# EAGLE design Dawson_Dolansky_sch (EAGLE 9.6.2)
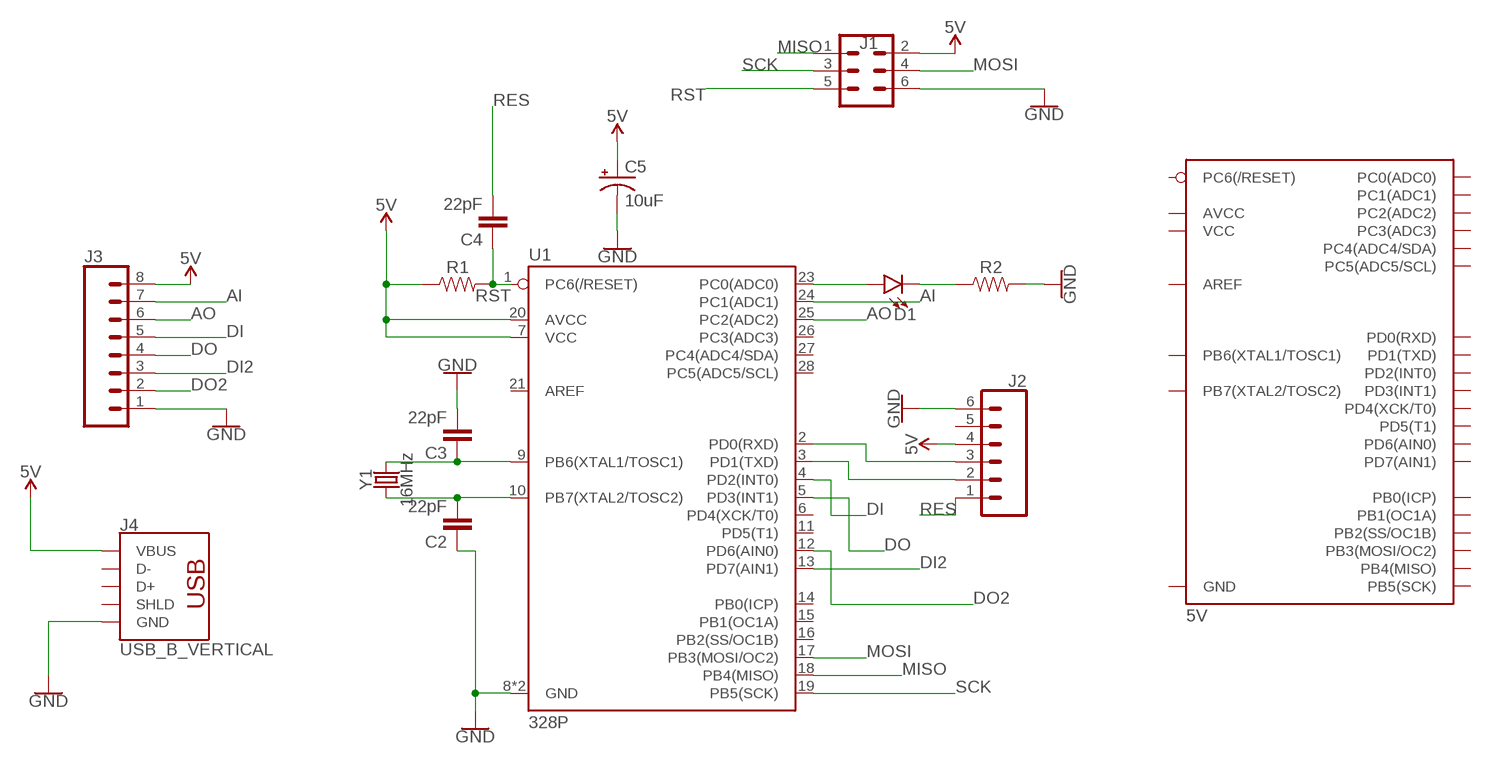
[diagram p0: schematic, sheet 1]

## Parts
C2  22pF  22PF-PTH-2.54MM-200V-5%  [CAP-PTH-2.54]
C3  22pF  22PF-PTH-2.54MM-200V-5%  [CAP-PTH-2.54]
C4  22pF  22PF-PTH-2.54MM-200V-5%  [CAP-PTH-2.54]
C5  10uF  10UF-POLAR-RADIAL-2.5MM-25V-20%  [CPOL-RADIAL-2.5MM-5MM]
D1  LED5MM  [LED_5MM]
J1  CONN_03X22X3_SILK_MALE_PTH  [2X3]
J2  CONN_06SILK_FEMALE_PTH  [1X06]
J3  CONN_08"  [1X08]
J4  USB_B_VERTICAL  [USB_B_VERTICAL_PTH]
R1  RESISTORAXIAL-0.3  [AXIAL-0.3]
R2  RESISTORAXIAL-0.3  [AXIAL-0.3]
U1  328P  ATMEGA328P_PDIP  [DIP28]
Y1  16MHz  CRYSTAL-16MHZPTH-HC49US  [HC49US]

## Nets
5V: C5.1(+) J1.2 J2.4 J3.8 J4.1(VBUS) R1.P$1 U1.7(VCC) U1.20(AVCC)
AI: J3.7 U1.24(PC1(ADC1))
AO: J3.6 U1.25(PC2(ADC2))
DI: J3.5 U1.4(PD2(INT0))
DI2: J3.3 U1.13(PD7(AIN1))
DO: J3.4 U1.5(PD3(INT1))
DO2: J3.2 U1.12(PD6(AIN0))
GND: C2.1 C3.2 C5.2(-) J1.6 J2.6 J3.1 J4.4(GND) R2.P$2 U1.8(GND) U1.22(GND)
MISO: J1.1 U1.18(PB4(MISO))
MOSI: J1.4 U1.17(PB3(MOSI/OC2))
N$2: C2.2 U1.10(PB7(XTAL2/TOSC2)) Y1.1
N$3: C3.1 U1.9(PB6(XTAL1/TOSC1)) Y1.2
N$4: J2.2 U1.3(PD1(TXD))
N$5: J2.3 U1.2(PD0(RXD))
N$13: D1.A U1.23(PC0(ADC0))
N$21: D1.K(C) R2.P$1
RES: C4.2 J2.1
RST: C4.1 J1.5 R1.P$2 U1.1(PC6(/RESET))
SCK: J1.3 U1.19(PB5(SCK))
Unconnected: J2.5 J4.2(D-) J4.3(D+) J4.5(SHLD) J4.6(SHLD) U1.6(PD4(XCK/T0)) U1.11(PD5(T1)) U1.14(PB0(ICP)) U1.15(PB1(OC1A)) U1.16(PB2(SS/OC1B)) U1.21(AREF) U1.26(PC3(ADC3)) U1.27(PC4(ADC4/SDA)) U1.28(PC5(ADC5/SCL))

## Library data of the parts
C2-C4 = JMU_intro:22PF: 22pF ceramic capacitors A capacitor is a passive two-terminal electrical component used to store electrical energy temporarily in an electric field.; PROD_ID: CAP-09128
C5 = JMU_intro:10UF-POLAR: 10.0µF polarized capacitors A capacitor is a passive two-terminal electrical component used to store electrical energy temporarily in an electric field.; PROD_ID: CAP-08440
D1 = JMU_intro:LED: LED (Generic) Standard schematic elements and footprints for 5mm, 3mm, 1206, and 0603 sized LEDs. Generic LEDs with no color specified.
J1 = JMU_intro:CONN_03X2: Multi connection point. Often used as Generic Header-pin footprint for 0.1 inch spaced/style header connections You can populate with any combo of single row headers, but if you'd like an exact match, check these: Header - 2x3 (Male, 0.1") <https://www.sparkfun.com/products/12807> (PRT-12807) Header - 2x3 (Female, 0.1") <https://www.sparkfun.com/products/13010> (PRT-13010) 2x3 Pin Shrouded Header <https://www.sparkfun.com/products/10877> (PRT-10877) On any of the 0.1 inch spaced packages, you can populate with these: Break Away Headers - Straight <https://www.sparkfun.com/products/116> (PRT-00116) Break Away Male Headers - Right Angle <https://www.sparkfun.com/products/553> (PRT-00553) Female Headers <https://www.sparkfun.com/products/115> (PRT-00115) Break Away Headers - Machine Pin <https://www.sparkfun.com/products/117> (PRT-00117) Break Away Female Headers - Swiss Machine Pin <https://www.sparkfun.com/products/743> (PRT-00743) Special note: the shrouded connector mates well with our 3x2 ribbon cables: Ribbon Crimp Connector - 6-pin (2x3, Female) <https://www.sparkfun.com/products/10651> (PRT-10651) Ribbon Cable - 6 wire (15ft) <https://www.sparkfun.com/products/10646> (PRT-10646); PROD_ID: CONN-09701
J2 = JMU_intro:CONN_06: Multi connection point. Often used as Generic Header-pin footprint for 0.1 inch spaced/style header connections On any of the 0.1 inch spaced packages, you can populate with these: Break Away Headers - Straight <https://www.sparkfun.com/products/116> (PRT-00116) Break Away Male Headers - Right Angle <https://www.sparkfun.com/products/553> (PRT-00553) Female Headers <https://www.sparkfun.com/products/115> (PRT-00115) Break Away Headers - Machine Pin <https://www.sparkfun.com/products/117> (PRT-00117) Break Away Female Headers - Swiss Machine Pin <https://www.sparkfun.com/products/743> (PRT-00743) Arduino Stackable Header - 6 Pin <https://www.sparkfun.com/products/9280> (PRT-09280) For SCREWTERMINALS and SPRING TERMINALS visit here: Screw Terimnals on SparkFun.com <https://www.sparkfun.com/search/results?term=Screw+Terminals> (5mm/3.5mm/2.54mm spacing) This device is also useful as a general connection point to wire up your design to another part of your project. Our various solder wires solder well into these plated through hole pads. Hook-Up Wire - Assortment (Stranded, 22 AWG) <https://www.sparkfun.com/products/11375> (PRT-11375) Hook-Up Wire - Assortment (Solid Core, 22 AWG) <https://www.sparkfun.com/products/11367> (PRT-11367) View the entire wire category on our website here <https://www.sparkfun.com/categories/141>; PROD_ID: CONN-08437
J3 = JMU_intro:CONN_08: Multi connection point. Often used as Generic Header-pin footprint for 0.1 inch spaced/style header connections On any of the 0.1 inch spaced packages, you can populate with these: Break Away Headers - Straight <https://www.sparkfun.com/products/116> (PRT-00116) Break Away Male Headers - Right Angle <https://www.sparkfun.com/products/553> (PRT-00553) Female Headers <https://www.sparkfun.com/products/115> (PRT-00115) Break Away Headers - Machine Pin <https://www.sparkfun.com/products/117> (PRT-00117) Break Away Female Headers - Swiss Machine Pin <https://www.sparkfun.com/products/743> (PRT-00743) Arduino Stackable Header - 8 Pin <https://www.sparkfun.com/products/9279> (PRT-09279) For SCREWTERMINALS and SPRING TERMINALS visit here: Screw Terimnals on SparkFun.com <https://www.sparkfun.com/search/results?term=Screw+Terminals> (5mm/3.5mm/2.54mm spacing) This device is also useful as a general connection point to wire up your design to another part of your project. Our various solder wires solder well into these plated through hole pads. Hook-Up Wire - Assortment (Stranded, 22 AWG) <https://www.sparkfun.com/products/11375> (PRT-11375) Hook-Up Wire - Assortment (Solid Core, 22 AWG) <https://www.sparkfun.com/products/11367> (PRT-11367) View the entire wire category on our website here <https://www.sparkfun.com/categories/141> Special notes: Molex polarized connector foot print use with SKU : PRT-08231 with associated crimp pins and housings. 1MM SMD Version SKU: PRT-10208 NOTES ON THE VARIANTS LOCK and LOCK_LONGPADS... This footprint was designed to help hold the alignment of a through-hole component (i.e. 6-pin header) while soldering it into place. You may notice that each hole has been shifted either up or down by 0.005 of an inch from it's more standard position (which is a perfectly straight line). This slight alteration caused the pins (the squares in the middle) to touch the edges of the holes. Because they are alternating, it causes a "brace" to hold the component in place. 0.005 has proven to be the perfect amount of "off-center" position when using our standard breakaway headers. Although looks a little odd when you look at the bare footprint, once you have a header in there, the alteration is very hard to notice. Also,if you push a header all the way into place, it is covered up entirely on the bottom side.; PROD_ID: CONN-08438
J4 = JMU_intro:USB_B: USB Type B Connector SparkFun Products: SparkFun Stepoko <https://www.sparkfun.com/products/13899> PTH
R1 R2 = JMU_intro:RESISTOR: Generic Resistor Package
U1 = JMU_intro:ATMEGA328P_PDIP: Atmel 328P Through hole ATMEGA328P uC used in the Arduino 32kb flash, 1k EEPROM, 2k SRAM Datasheet <http://www.sparkfun.com/datasheets/Components/SMD/ATMega328.pdf> SparkFun Products Storefront component: AVR 28 Pin 20MHz 32K 6A/D - ATMega328P <https://www.sparkfun.com/products/9061> (COM-09061) SparkFun Simon Says - Through-Hole Soldering Kit <https://www.sparkfun.com/products/10547> (KIT-10547) SparkFun Learn to Solder - Simon Says <https://www.sparkfun.com/products/13708> (KIT-13708) SparkFun BigTime Watch Kit <https://www.sparkfun.com/products/11734> (KIT-11734) SparkFun ClockIt <https://www.sparkfun.com/products/10930> (KIT-10930) SparkFun Serial Enabled LCD Kit <https://www.sparkfun.com/products/10097> (LCD-10097) SparkFun Simon Tilts - Through Hole Soldering Kit <https://www.sparkfun.com/products/12634> (KIT-12634) SparkFun Frequency Counter Kit <https://www.sparkfun.com/products/10140> (KIT-10140) FabFM Radio Kit <https://www.sparkfun.com/products/11043> (KIT-11043) SparkFun Binary Blaster Kit <https://www.sparkfun.com/products/12037> (KIT-12037) SparkFun Metro-Gnome <https://www.sparkfun.com/products/9236> (KIT-09236) ATmega328 with Arduino Optiboot (Uno) <https://www.sparkfun.com/products/10524> (DEV-10524); PROD_ID: IC-09136
Y1 = JMU_intro:CRYSTAL-16MHZ: 16MHz Crystal Digikey Example <http://www.digikey.com/product-search/en?keywords=535-9122-1-ND> Frequency: 16MHz Frequency Stability: ±50ppm Frequency Tolerance: ±20ppm Load Capacitance: 18pF SparkFun Products: Pro Micro -5V/16MHz <https://www.sparkfun.com/products/12640> SparkFun Serial Enabled LCD Kit <https://www.sparkfun.com/products/10097>; PROD_ID: XTAL-08181; SF_ID: COM-00536

## Board
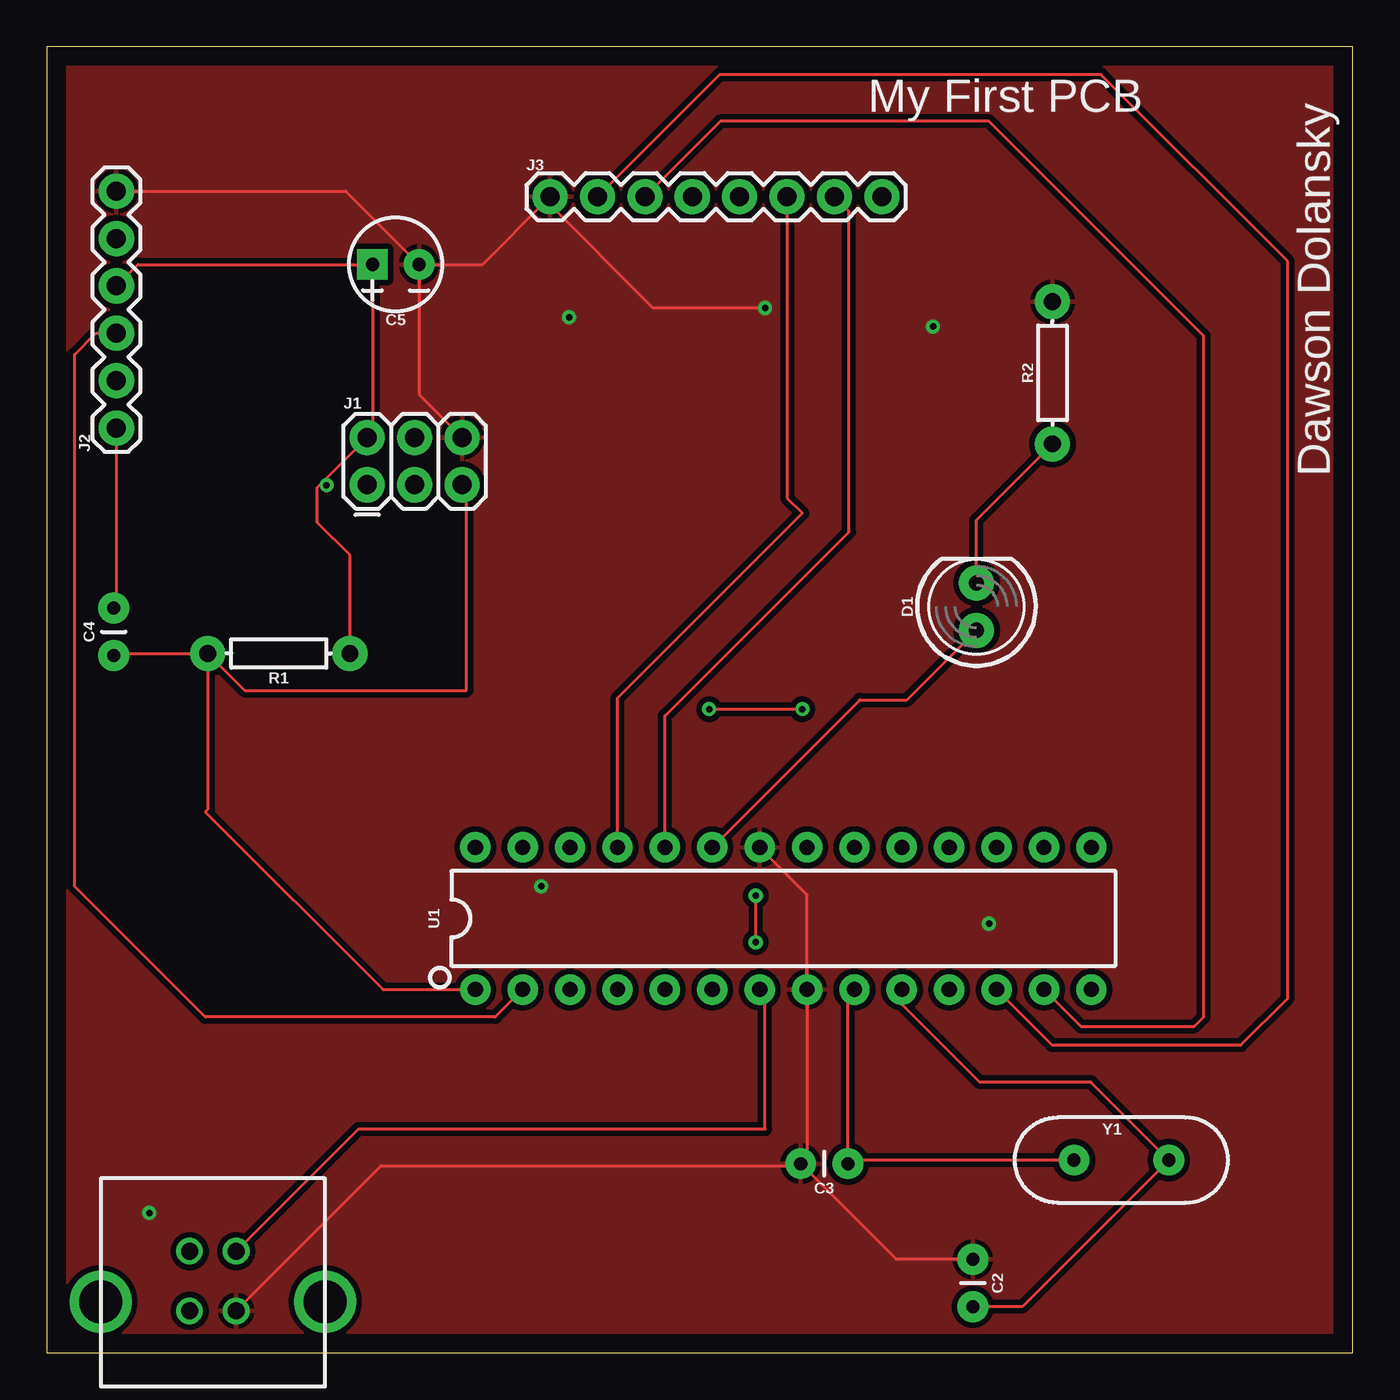
[diagram p1: board, top side]
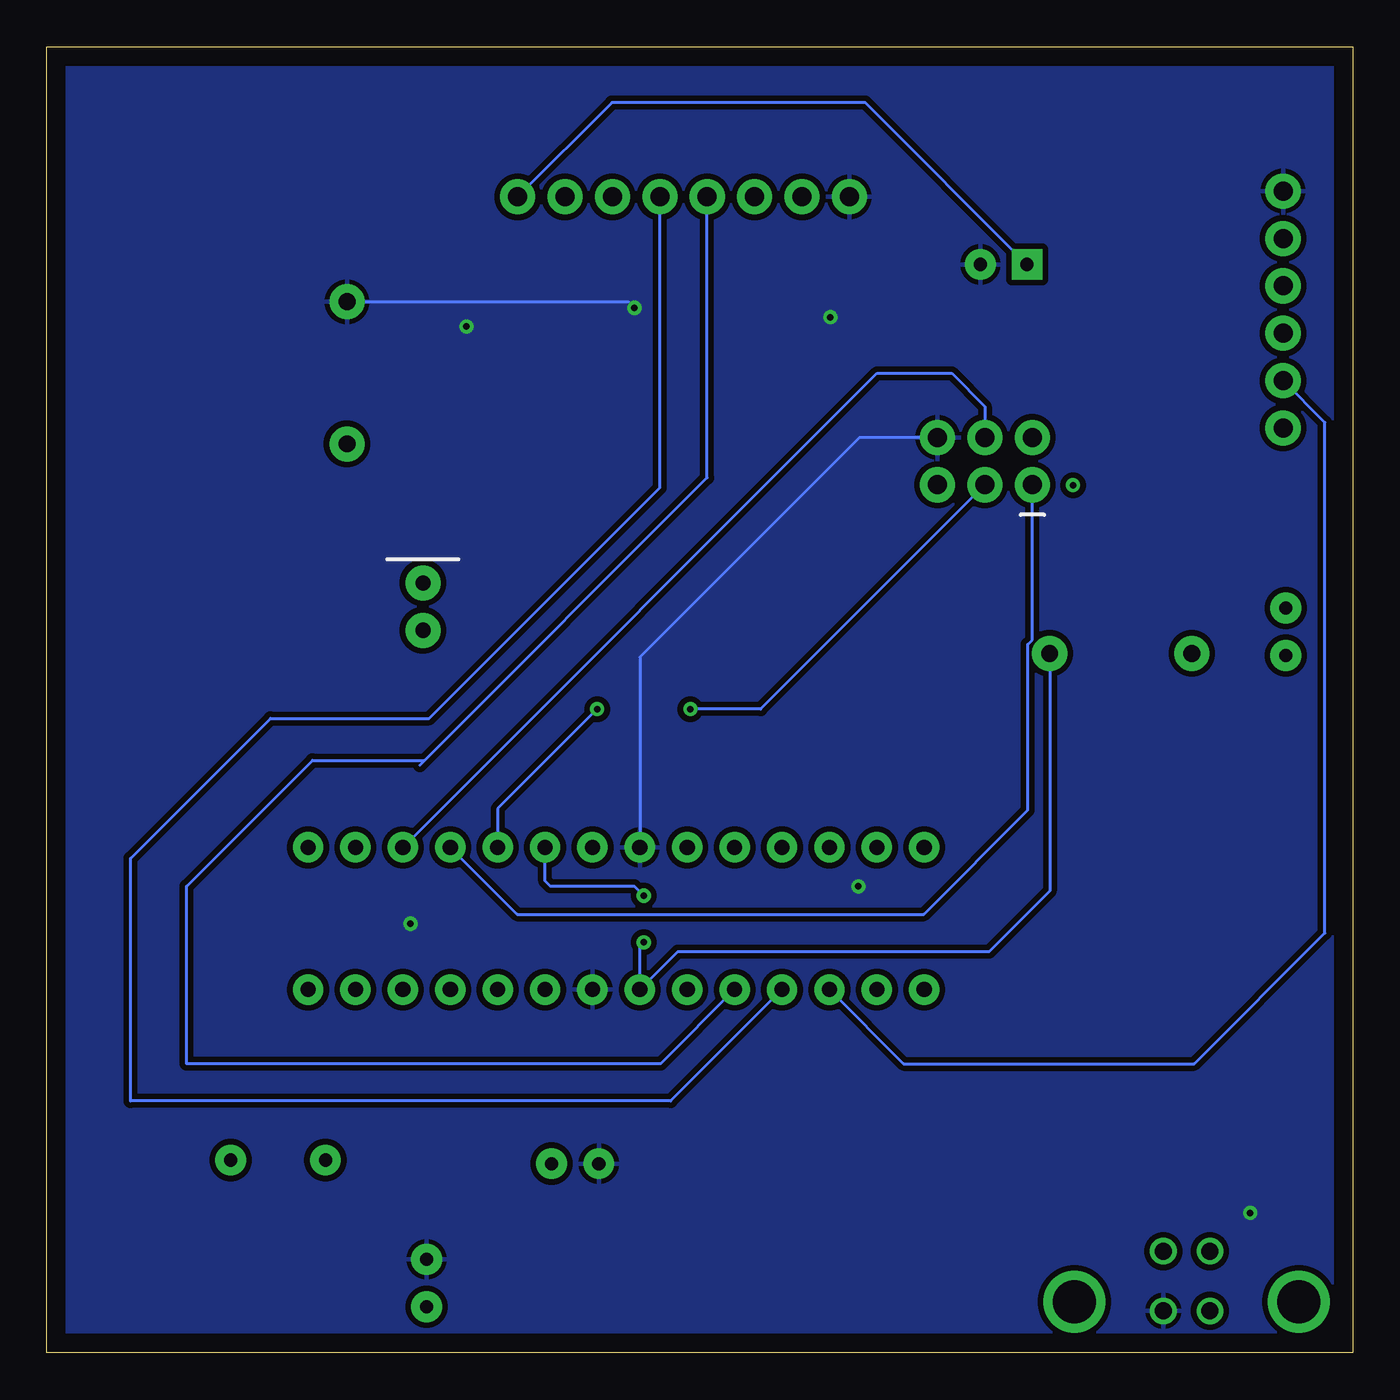
[diagram p2: board, bottom side, seen from below]

Size 70 x 70 mm. Coordinates in mm from the lower left corner, seen from the top.
Outline: 0,0 70,0 70,70 0,70 0,0
Copper layers (1*16): Top 0.035mm / dielectric 1.5mm / Bottom 0.035mm
Design rules "default": minimum track width 6mil, minimum drill 0.35mm, track to track 6mil, track to pad 6mil, pad to pad 6mil, via to via 6mil, smd to smd 6mil, copper to edge 40mil, drill to drill 6mil, minimum pad ring 10mil, minimum via ring 8mil, stop-mask expansion 4mil, vias tented up to drill 0mil, thermal gap 10mil

### Footprints (pad centres in the part's own frame; a part is rotated, then mirrored left to right if it is on the bottom)
CAP-PTH-2.54 = drill 0.7 pad 1.651: 1 -1.27,0; 2 1.27,0
CPOL-RADIAL-2.5MM-5MM = drill 0.7 pad 1.651 square: 1 1.25,0 | drill 0.7 pad 1.651: 2 -1.25,0
LED_5MM = drill 0.813 pad 1.88: A -1.27,0; K 1.27,0
2X3 = drill 1.016 pad 1.88: 1 0,0; 2 0,2.54; 3 2.54,0; 4 2.54,2.54; 5 5.08,0; 6 5.08,2.54
1X06 = drill 1.016 pad 1.88: 1 0,0; 2 2.54,0; 3 5.08,0; 4 7.62,0; 5 10.16,0; 6 12.7,0
1X08 = drill 1.016 pad 1.88: 1 0,0; 2 2.54,0; 3 5.08,0; 4 7.62,0; 5 10.16,0; 6 12.7,0; 7 15.24,0; 8 17.78,0
USB_B_VERTICAL_PTH = drill 0.92: 1 1.25,1.6; 2 -1.25,1.6; 3 -1.25,-1.6; 4 1.25,-1.6 | drill 2.3: 5 -6.02,-1.11; 6 6.02,-1.11
AXIAL-0.3 = drill 0.9 pad 1.88: P$1 -3.81,0; P$2 3.81,0
DIP28 = drill 0.813 pad 1.626: 1 -16.51,-3.81; 2 -13.97,-3.81; 3 -11.43,-3.81; 4 -8.89,-3.81; 5 -6.35,-3.81; 6 -3.81,-3.81; 7 -1.27,-3.81; 8 1.27,-3.81; 9 3.81,-3.81; 10 6.35,-3.81; 11 8.89,-3.81; 12 11.43,-3.81; 13 13.97,-3.81; 14 16.51,-3.81; 15 16.51,3.81; 16 13.97,3.81; 17 11.43,3.81; 18 8.89,3.81; 19 6.35,3.81; 20 3.81,3.81; 21 1.27,3.81; 22 -1.27,3.81; 23 -3.81,3.81; 24 -6.35,3.81; 25 -8.89,3.81; 26 -11.43,3.81; 27 -13.97,3.81; 28 -16.51,3.81
HC49US = drill 0.7 pad 1.651: 1 -2.54,0; 2 2.54,0

### Placement (x,y rotation side)
C2  49.64,3.74 270 top
C3  41.68,10.14 180 top
C4  3.6,38.64 90 top
C5  18.71,58.33 180 top
D1  49.83,39.99 90 top
J1  17.18,46.52 0 top
J2  3.74,49.56 90 top
J3  26.98,61.95 0 top
J4  8.91,3.85 0 top
R1  12.44,37.48 180 top
R2  53.9,52.52 90 top
U1  39.48,23.28 0 top
Y1  57.6,10.33 180 top

### Tracks (layer width: path | path; a pad name or v marks a point on that pad's centre or on a via)
5V  (via drill 0.35)
  Top 0.152: J2.4 4.89,58.33 C5.1 17.46,49.34 J1.2 14.5,46.38 14.5,44.5 16.25,42.75 R1.P$1 | U1.7 38.21,19.21 38.5,18.92 38.5,12 16.71,12 J4.1 | v38,22 v38,24.5
  Bottom 0.152: C5.1 26.13,67 39.71,67 J3.8 | R1.P$1 16.25,24.75 19.5,21.5 36.18,21.5 U1.7 38.21,21.79 v38,22 | v38,24.5 38.5,25 43,25 43.29,25.29 U1.20
AI
  Top 0.152: U1.24 33.13,34.13 43,44 43,61.17 J3.7
AO
  Top 0.152: U1.25 30.59,35.09 40.5,45 39.68,45.82 J3.6
DI
  Bottom 0.152: U1.4 36.56,13.5 65.5,13.5 65.5,26.5 58,34 49.5,34 37.14,46.36 J3.5 37.55,61.95
DI2
  Top 0.152: U1.13 55.42,17.5 61.5,17.5 62,18 62,54.5 50.5,66 36.11,66 J3.3
DO
  Bottom 0.152: U1.5 37.1,15.5 62.5,15.5 62.5,25 55.75,31.75 49.75,31.75 | 50,31.5 49.75,31.75 | 49.75,31.75 34.6,46.9 J3.4
DO2
  Top 0.152: U1.12 53.88,16.5 64,16.5 66.5,19 66.5,58.5 56.5,68.5 36.07,68.5 J3.2
GND  (via drill 0.35)
  Top 0.152: J2.6 16.03,62.26 C5.2 | C2.1 45.54,5.01 40.52,10.03 | 40.52,10.03 C3.2 40.75,10.48 U1.8 40.75,24.55 U1.22 | J3.1 26.77,61.73 | 26.77,61.73 23.36,58.33 C5.2 | C5.2 19.96,51.36 J1.6 | J4.4 17.93,10.03 40.52,10.03 | v38.5,56 32.5,56 26.77,61.73
  Bottom 0.152: J1.6 26.44,49.06 38.21,37.29 U1.22 | R2.P$2 38.83,56.33 v38.5,56
  other vias: 5.5,7.5 26.5,25 50.5,23 47.5,55 28,55.5
  pour Bottom (isolate 0.305): 0,0 70,0 70,70 0,70
  pour Top (isolate 0.305): 0,70 0,0 70,0 70,70
MISO
  Bottom 0.152: U1.18 44.78,23.5 23,23.5 17.42,29.08 17.42,37.96 17.18,38.2 J1.1
MOSI
  Bottom 0.152: U1.17 25.5,52.5 21.5,52.5 19.72,50.72 J1.4
N$1  (via drill 0.35)
  other vias: 15,46.5
N$2
  Top 0.152: C2.2 52.28,2.47 Y1.1 55.97,14.5 50,14.5 45.83,18.67 U1.10
N$3
  Top 0.152: U1.9 42.95,19.13 C3.1 43.14,10.33 Y1.2
N$4
  Bottom 0.152: U1.3 24.08,15.5 8.5,15.5 1.5,22.5 1.5,49.86 J2.2
N$5
  Top 0.152: U1.2 24.04,18 8.5,18 1.5,25 1.5,53.5 2.64,54.64 J2.3
N$13
  Top 0.152: U1.23 43.58,35 46.11,35 D1.A
N$21
  Top 0.152: D1.K 49.83,44.64 R2.P$1
RES
  Top 0.152: J2.1 3.74,40.05 C4.2
RST
  Top 0.152: C4.1 3.71,37.48 R1.P$2 | R1.P$2 10.61,35.5 22.5,35.5 22.5,46.28 J1.5 | R1.P$2 8.63,29.13 8.5,29 18.03,19.47 U1.1
SCK  (via drill 0.35)
  Top 0.152: v35.5,34.5 v40.5,34.5
  Bottom 0.152: 20,46.24 J1.3 31.74,34.5 v35.5,34.5 | 45.83,28.17 U1.19 45.83,29.17 v40.5,34.5

### Text on the board
tPlace: Dawson Dolansky | My First PCB